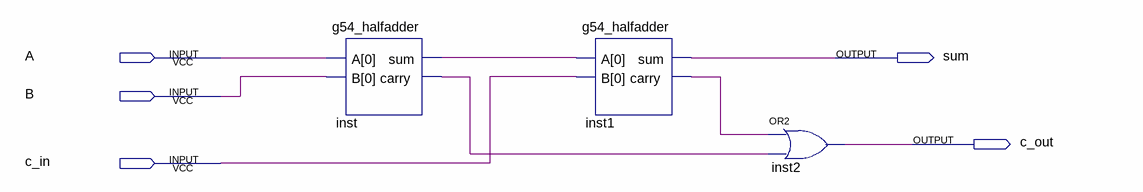
[diagram p0: schematic sheet]
// Quartus schematic g54_fulladder.bdf as structural Verilog: 3 symbols, 5 pins
module g54_fulladder (
  input  A,
  input  B,
  input  c_in,
  output sum,
  output c_out
);

  wire inst1_carry, inst_carry, inst_sum;

  g54_halfadder inst (.A(A), .B(B), .sum(inst_sum), .carry(inst_carry));
  g54_halfadder inst1 (.A(inst_sum), .B(c_in), .sum(sum), .carry(inst1_carry));
  or inst2 (c_out, inst1_carry, inst_carry);
endmodule
